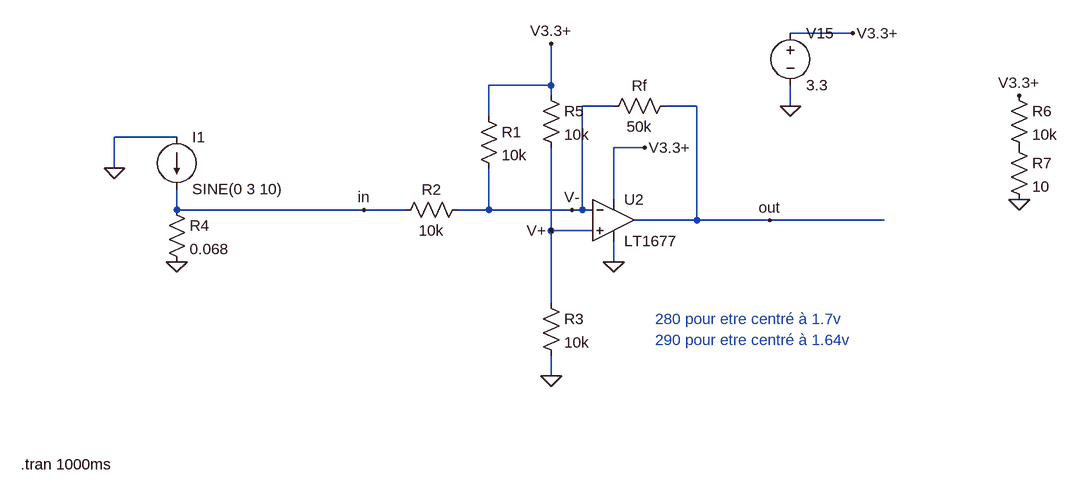
[diagram p0: schematic currentSensesumming.asc]
currentSensesumming.asc, the LTspice schematic file:
Version 4
SHEET 1 2228 740
WIRE 1904 -528 1808 -528
WIRE 1440 -448 1440 -512
WIRE 1440 -448 1344 -448
WIRE 1440 -432 1440 -448
WIRE 1536 -416 1488 -416
WIRE 1664 -416 1616 -416
WIRE 1808 -416 1808 -448
WIRE 1344 -400 1344 -448
WIRE 864 -368 768 -368
WIRE 1584 -352 1536 -352
WIRE 768 -320 768 -368
WIRE 1536 -272 1536 -352
WIRE 864 -256 864 -288
WIRE 1152 -256 864 -256
WIRE 1216 -256 1152 -256
WIRE 1344 -256 1344 -320
WIRE 1344 -256 1296 -256
WIRE 1472 -256 1344 -256
WIRE 1488 -256 1488 -416
WIRE 1488 -256 1472 -256
WIRE 1504 -256 1488 -256
WIRE 1664 -240 1664 -416
WIRE 1664 -240 1568 -240
WIRE 1776 -240 1664 -240
WIRE 1952 -240 1776 -240
WIRE 1440 -224 1440 -352
WIRE 1504 -224 1440 -224
WIRE 1536 -176 1536 -208
WIRE 1440 -112 1440 -224
WIRE 1440 0 1440 -32
FLAG 1536 -176 0
FLAG 1776 -240 out
FLAG 1808 -416 0
FLAG 1904 -528 V3.3+
FLAG 1584 -352 V3.3+
FLAG 1472 -256 V-
FLAG 1440 -512 V3.3+
FLAG 1440 -224 V+
FLAG 864 -176 0
FLAG 1152 -256 in
FLAG 768 -320 0
FLAG 1440 0 0
FLAG 2160 -432 V3.3+
FLAG 2160 -272 0
SYMBOL res 1632 -432 R90
WINDOW 0 0 56 VBottom 2
WINDOW 3 32 56 VTop 2
SYMATTR InstName Rf
SYMATTR Value 50k
SYMBOL res 1200 -240 R270
WINDOW 0 32 56 VTop 2
WINDOW 3 0 56 VBottom 2
SYMATTR InstName R2
SYMATTR Value 10k
SYMBOL voltage 1808 -544 R0
WINDOW 123 0 0 Left 2
WINDOW 39 0 0 Left 2
SYMATTR InstName V15
SYMATTR Value 3.3
SYMBOL res 1424 -128 R0
SYMATTR InstName R3
SYMATTR Value 10k
SYMBOL Opamps\\LT1677 1536 -304 R0
SYMATTR InstName U2
SYMBOL current 864 -368 R0
WINDOW 123 0 0 Left 2
WINDOW 39 0 0 Left 2
SYMATTR InstName I1
SYMATTR Value SINE(0 3 10)
SYMBOL res 848 -272 R0
SYMATTR InstName R4
SYMATTR Value 0.068
SYMBOL res 2144 -448 R0
SYMATTR InstName R6
SYMATTR Value 10k
SYMBOL res 2144 -368 R0
SYMATTR InstName R7
SYMATTR Value 10
SYMBOL res 1424 -448 R0
SYMATTR InstName R5
SYMATTR Value 10k
SYMBOL res 1328 -416 R0
SYMATTR InstName R1
SYMATTR Value 10k
TEXT 624 136 Left 2 !.tran 1000ms
TEXT 1600 -56 Left 2 ;290 pour etre centré à 1.64v
TEXT 1600 -88 Left 2 ;280 pour etre centré à 1.7v

The netlist it stands for:
* currentSensesumming.asc
Rf out V- 50k
R2 in V- 10k
V15 V3.3+ 0 3.3
R3 V+ 0 10k
XU2 V+ V- V3.3+ 0 out LT1677  ; pins In+ In- V+ V- OUT
I1 0 in SINE(0 3 10)
R4 in 0 0.068
R6 V3.3+ P001 10k
R7 P001 0 10
R5 V3.3+ V+ 10k
R1 V3.3+ V- 10k
.tran 1000ms
* 290 pour etre centré à 1.64v
* 280 pour etre centré à 1.7v
.lib LTC.lib
.backanno
.end